# EAGLE schematic Copperclad_CooperBuffer_Amp_V0-5 (EAGLE 7.5.0)
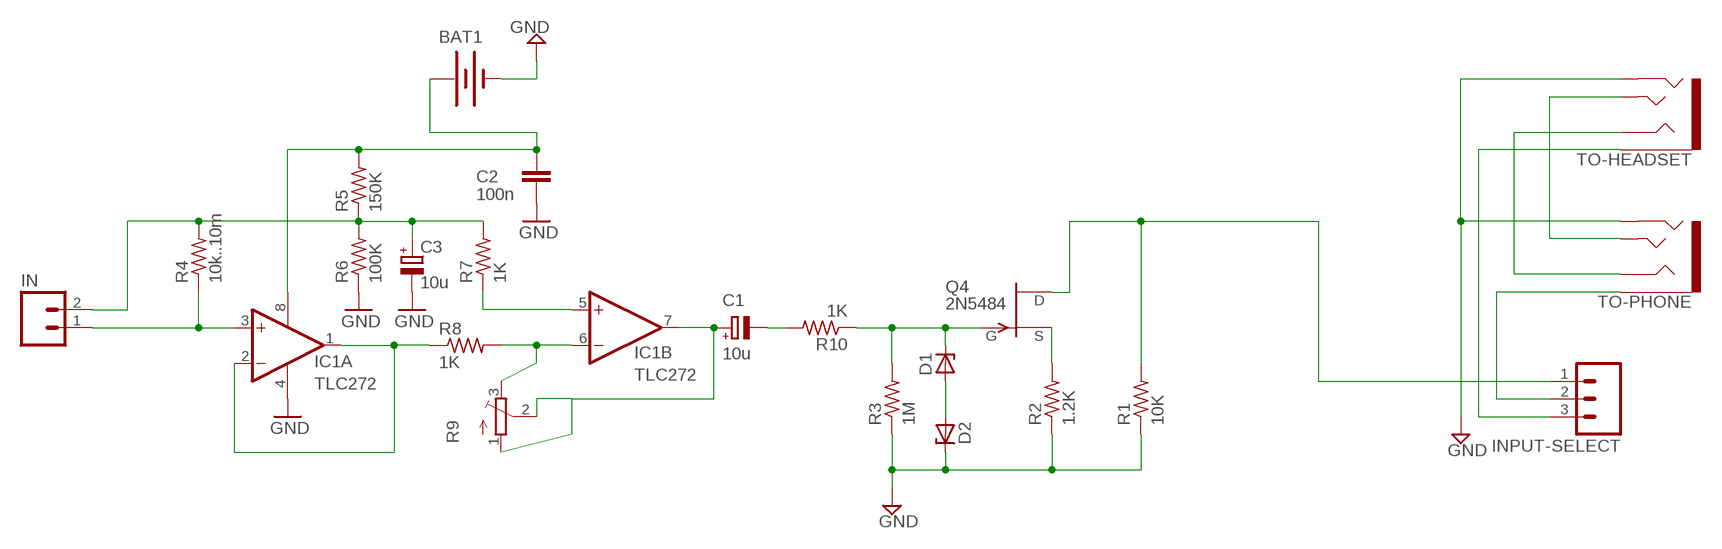
[diagram p0: schematic, sheet 1]

## Parts
BAT1  BATTERYA23  [BATTERY-A23]
C1  10u  CPOL-EUE2.5-5  [E2,5-5]
C2  100n  C-EU025-025X050  [C025-025X050]
C3  10u  CPOL-EUE2.5-5  [E2,5-5]
D1  1N821  [DO35Z10]
D2  1N821  [DO35Z10]
IC1  TLC272  TLC272P  [DIL08]
IN  M02LOCK  [1X02_LOCK]
INPUT-SELECT  M03LOCK  [1X03_LOCK]
Q4  2N5484  [TO92-]
R1  10K  R-US_0204/2V  [0204V]
R2  1.2K  R-US_0204/2V  [0204V]
R3  1M  R-US_0204/2V  [0204V]
R4  10k..10m  R-US_0204/2V  [0204V]
R5  150K  R-US_0204/2V  [0204V]
R6  100K  R-US_0204/2V  [0204V]
R7  1K  R-US_0204/2V  [0204V]
R8  1K  R-US_0204/2V  [0204V]
R9  TRIMPOT3386  [TRIM-3386]
R10  1K  R-US_0204/2V  [0204V]
TO-HEADSET  AUDIO-JACK3  [AUDIO-JACK-TRRS-SMD]
TO-PHONE  AUDIO-JACK3  [AUDIO-JACK-TRRS-SMD]

## Nets
`DEL: INPUT-SELECT.1 Q4.3(D) R1.2
GND: BAT1.GND@1(-) C2.1 C3.- D2.C IC1.4(P:V-) R1.1 R2.1 R3.1 R6.1 TO-HEADSET.RING2 TO-PHONE.RING2
N$1: D1.A D2.A
N$3: Q4.2(S) R2.2
N$5: IC1.5(B:+IN) R7.1
N$6: C1.+ IC1.7(B:OUT) R9.1(A) R9.2(S)
N$7: IC1.6(B:-IN) R8.2 R9.3(E)
N$8: C3.+ IN.2 R4.2 R5.1 R6.2 R7.2
N$9: IC1.3(A:+IN) IN.1 R4.1
N$10: D1.C Q4.1(G) R3.2 R10.1
N$11: C1.- R10.2
N$12: INPUT-SELECT.3 TO-HEADSET.EARTH
N$13: TO-HEADSET.TIP TO-PHONE.TIP
N$14: IC1.1(A:OUT) IC1.2(A:-IN) R8.1
N$15: TO-HEADSET.RING1 TO-PHONE.RING1
TO-PHONE: INPUT-SELECT.2 TO-PHONE.EARTH
V9V: BAT1.PWR@1(+) C2.2 IC1.8(P:V+) R5.2

## Library data of the parts
BAT1 = Daniel:BATTERY: Battery Holders Various common sizes : AA, AAA, 18650 (PRT-12895), 20mm coin cell and 12mm coin cell. 20MM_4LEGS, BATT-10373
C1 C3 = rcl:CPOL-EU: POLARIZED CAPACITOR, European symbol
C2 = rcl:C-EU: CAPACITOR, European symbol
D1 D2 = diode:1N821: Reference DIODE temperature compensated, 6,2 V
IC1 = linear:TLC272: OP AMP
IN = SparkFun-Connectors:M02: Header 2 Standard 2-pin 0.1" header. Use with straight break away headers (SKU : PRT-00116), right angle break away headers (PRT-00553), swiss pins (PRT-00743), machine pins (PRT-00117), and female headers (PRT-00115). Molex polarized connector foot print use with SKU : PRT-08233 with associated crimp pins and housings.
INPUT-SELECT = SparkFun-Connectors:M03: Header 3 Standard 3-pin 0.1" header. Use with straight break away headers (SKU : PRT-00116), right angle break away headers (PRT-00553), swiss pins (PRT-00743), machine pins (PRT-00117), and female headers (PRT-00115). Molex polarized connector foot print use with SKU : PRT-08232 with associated crimp pins and housings.
Q4 = transistor-fet:?548*: N-Channel JFETs Source: VISHAY 2N5484.pdf Compatible: TO92 2N5245 J304 J305 U310 J308 J309 J310 TO72 2N4416 2N4416A 2N3823 2N4351 3N169 3N170 3N171 MFE3002 TO18 2N3796 2N3797 MFE825 Source: Motorola European Master Guide Pacge 3-59
R1-R8 R10 = resistor:R-US_: RESISTOR, American symbol
R9 = adafruit:TRIMPOT: SMT trimmer potentiometer part number TC33X http://www.ladyada.net/library/eagle
TO-HEADSET TO-PHONE = SparkFun-Connectors:AUDIO-JACK3: Audio jack - 3.5mm TRRS variety - two rings.

## Net classes
0 default: width 0.6 mm, clearance 0.2 mm